# Altium schematic sheet MC21R01_Inverter_2.SchDoc: MC21R01 Top Level
size A3; Author: AMP; DrawnBy: AMP; Organization: Altium Limited; Address1: 3 Minna Close; Address2: Belrose; Address3: NSW 2085; Address4: Australia; DocumentNumber: 0; Revision: 1.0; SheetNumber: 0; SheetTotal: 0
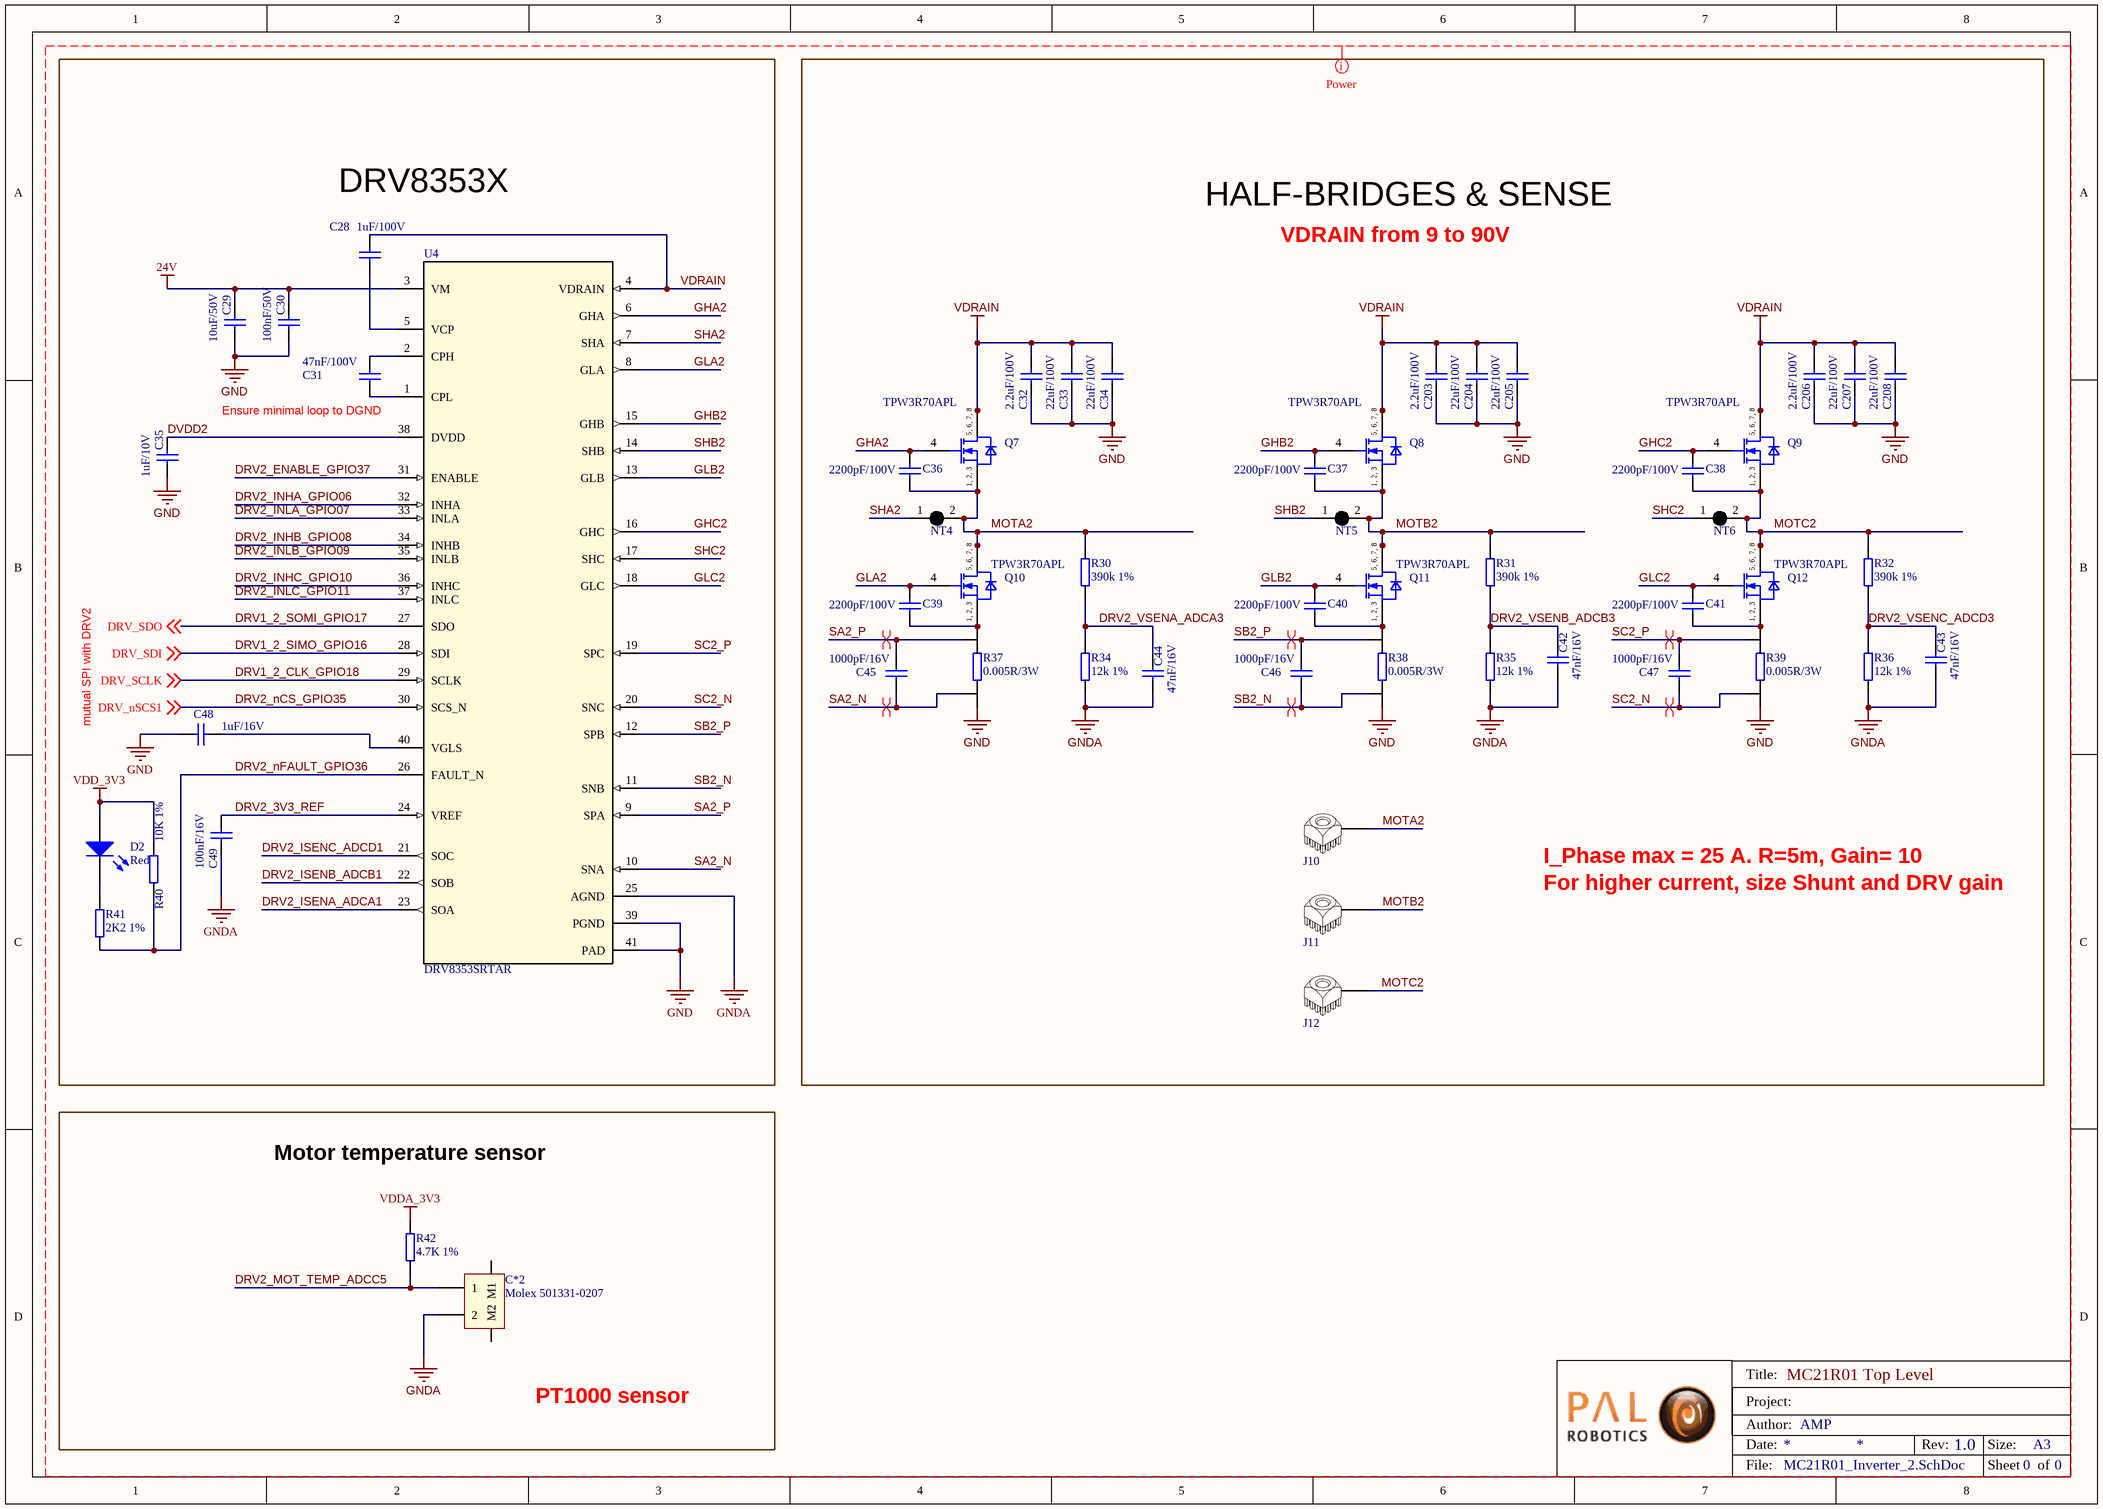
[diagram p0: MC21R01_Inverter_2.SchDoc]

## Parts
C28  value 1uF/100V  [0805 SMD capacitor]  (hidden comment: 1uF/100V 0805 10% X7R)
C29  value 10uF/50V  [1206 SMD Capacitor]  (hidden comment: 10uf/50V 1206 20% X5R)
C30  value 100nF/50V  [0603 SMD capacitor]  (hidden comment: 100nF/50V 0603 10% X7R)
C31  value 47nF/100V  [0603 SMD capacitor]  (hidden comment: 47nF/100V 0603 10% X7R)
C32  value 2.2uF/100V  [1210 SMD capacitor h=2mm]  (hidden comment: 2.2uF/100V 1210 10% X7R)
C33  value 22uF/100V  [2220 SMD Capacitor H=5MM]  (hidden comment: 22uF/100V 2220 20% X7S)
C34  value 22uF/100V  [2220 SMD Capacitor H=5MM]  (hidden comment: 22uF/100V 2220 20% X7S)
C35  value 1uF/10V  [0603 SMD capacitor]  (hidden comment: 1uF/10V 0603 10% X7R)
C36  value 2200pF/100V  [0402 SMD Capacitor]  (hidden comment: 2200pF/100V 0402 10% X7S)
C37  value 2200pF/100V  [0402 SMD Capacitor]  (hidden comment: 2200pF/100V 0402 10% X7S)
C38  value 2200pF/100V  [0402 SMD Capacitor]  (hidden comment: 2200pF/100V 0402 10% X7S)
C39  value 2200pF/100V  [0402 SMD Capacitor]  (hidden comment: 2200pF/100V 0402 10% X7S)
C40  value 2200pF/100V  [0402 SMD Capacitor]  (hidden comment: 2200pF/100V 0402 10% X7S)
C41  value 2200pF/100V  [0402 SMD Capacitor]  (hidden comment: 2200pF/100V 0402 10% X7S)
C42  value 47nF/16V  [0402 SMD Capacitor]  (hidden comment: 47nF/16V 0402 10% X7R)
C43  value 47nF/16V  [0402 SMD Capacitor]  (hidden comment: 47nF/16V 0402 10% X7R)
C44  value 47nF/16V  [0402 SMD Capacitor]  (hidden comment: 47nF/16V 0402 10% X7R)
C45  value 1000pF/16V  [0402 SMD Capacitor]  (hidden comment: 1000pF/16V 0402 10% X7R)
C46  value 1000pF/16V  [0402 SMD Capacitor]  (hidden comment: 1000pF/16V 0402 10% X7R)
C47  value 1000pF/16V  [0402 SMD Capacitor]  (hidden comment: 1000pF/16V 0402 10% X7R)
C48  value 1uF/16V  [0603 SMD capacitor]  (hidden comment: 1uF/16V 0603 10% X7R)
C49  value 100nF/16V  [0402 SMD Capacitor]  (hidden comment: 100nF/16V 0402 10% X7R)
C203  value 2.2uF/100V  [1210 SMD capacitor h=2mm]  (hidden comment: 2.2uF/100V 1210 10% X7R)
C204  value 22uF/100V  [2220 SMD Capacitor H=5MM]  (hidden comment: 22uF/100V 2220 20% X7S)
C205  value 22uF/100V  [2220 SMD Capacitor H=5MM]  (hidden comment: 22uF/100V 2220 20% X7S)
C206  value 2.2uF/100V  [1210 SMD capacitor h=2mm]  (hidden comment: 2.2uF/100V 1210 10% X7R)
C207  value 22uF/100V  [2220 SMD Capacitor H=5MM]  (hidden comment: 22uF/100V 2220 20% X7S)
C208  value 22uF/100V  [2220 SMD Capacitor H=5MM]  (hidden comment: 22uF/100V 2220 20% X7S)
C*2  Molex 501331-0207  [Molex 501331-0207]
D2  Red  [0402 SMD LED Red]
J10  WE_7461094  [WE_7461094]  (value not drawn)
J11  WE_7461094  [WE_7461094]  (value not drawn)
J12  WE_7461094  [WE_7461094]  (value not drawn)
NT4  Net Tie SMD  [Net Tie SMD 0.4x0.8mm]  (value not drawn)  (net tie, no BOM)
NT5  Net Tie SMD  [Net Tie SMD 0.4x0.8mm]  (value not drawn)  (net tie, no BOM)
NT6  Net Tie SMD  [Net Tie SMD 0.4x0.8mm]  (value not drawn)  (net tie, no BOM)
Q7  TPW3R70APL  [DSOP Advance Toshiba]
Q8  TPW3R70APL  [DSOP Advance Toshiba]
Q9  TPW3R70APL  [DSOP Advance Toshiba]
Q10  TPW3R70APL  [DSOP Advance Toshiba]
Q11  TPW3R70APL  [DSOP Advance Toshiba]
Q12  TPW3R70APL  [DSOP Advance Toshiba]
R30  390k 1%  [0603 SMD resistor]
R31  390k 1%  [0603 SMD resistor]
R32  390k 1%  [0603 SMD resistor]
R34  12k 1%  [0603 SMD resistor]
R35  12k 1%  [0603 SMD resistor]
R36  12k 1%  [0603 SMD resistor]
R37  0.005R/3W  [2512 SMD Resistor V2 NETTIE]
R38  0.005R/3W  [2512 SMD Resistor V2 NETTIE]
R39  0.005R/3W  [2512 SMD Resistor V2 NETTIE]
R40  10K 1%  [0402 SMD rESISTOR]
R41  2K2 1%  [0402 SMD rESISTOR]
R42  4.7K 1%  [0402 SMD rESISTOR]
U4  DRV8353SRTAR  [QFN50P600X600X80_HS-41N]

## Blocks framed on the sheet
DRV8353X: C28-C31 C35 C48 C49 D2 R40 R41 U4
HALF-BRIDGES & SENSE: C32-C34 C36-C47 C203-C208 J10-J12 NT4-NT6 Q7-Q12 R30-R32 R34-R39

## Nets
24V: C29.1 C30.1 U4.3(VM)
GND: C29.2 C30.2 C32.2 C33.2 C34.2 C35.2 C48.1 C203.2 C204.2 C205.2 C206.2 C207.2 C208.2 R37.1 R38.1 R39.1 U4.39(PGND) U4.41(PAD)
GNDA: C42.2 C43.2 C44.2 C49.2 C*2.2 R34.1 R35.1 R36.1 U4.25(AGND)
VDD_3V3: D2.A R40.2
VDDA_3V3: R42.2
VDRAIN: C28.1 C32.1 C33.1 C34.1 C203.1 C204.1 C205.1 C206.1 C207.1 C208.1 Q7.5(DRAIN) Q7.6(DRAIN) Q7.7(DRAIN) Q7.8(DRAIN) Q8.5(DRAIN) Q8.6(DRAIN) Q8.7(DRAIN) Q8.8(DRAIN) Q9.5(DRAIN) Q9.6(DRAIN) Q9.7(DRAIN) Q9.8(DRAIN) U4.4(VDRAIN)
DRV1_2_CLK_GPIO18: U4.29(SCLK) ; off-sheet DRV_SCLK  [also labelled DRV_SCLK]
DRV1_2_SIMO_GPIO16: U4.28(SDI) ; off-sheet DRV_SDI  [also labelled DRV_SDI]
DRV1_2_SOMI_GPIO17: U4.27(SDO) ; off-sheet DRV_SDO  [also labelled DRV_SDO]
DRV2_3V3_REF: C49.1 U4.24(VREF)
DRV2_ENABLE_GPIO37: U4.31(ENABLE)
DRV2_INHA_GPIO06: U4.32(INHA)
DRV2_INHB_GPIO08: U4.34(INHB)
DRV2_INHC_GPIO10: U4.36(INHC)
DRV2_INLA_GPIO07: U4.33(INLA)
DRV2_INLB_GPIO09: U4.35(INLB)
DRV2_INLC_GPIO11: U4.37(INLC)
DRV2_ISENA_ADCA1: U4.23(SOA)
DRV2_ISENB_ADCB1: U4.22(SOB)
DRV2_ISENC_ADCD1: U4.21(SOC)
DRV2_MOT_TEMP_ADCC5: C*2.1 R42.1
DRV2_nCS_GPIO35: U4.30(SCS_N) ; off-sheet DRV_nSCS1  [also labelled DRV_nSCS1]
DRV2_nFAULT_GPIO36: R40.1 R41.1 U4.26(FAULT_N)
DRV2_VSENA_ADCA3: C44.1 R30.1 R34.2
DRV2_VSENB_ADCB3: C42.1 R31.1 R35.2
DRV2_VSENC_ADCD3: C43.1 R32.1 R36.2
DVDD2: C35.1 U4.38(DVDD)
GHA2: C36.1 Q7.4(GATE) U4.6(GHA)
GHB2: C37.1 Q8.4(GATE) U4.15(GHB)
GHC2: C38.1 Q9.4(GATE) U4.16(GHC)
GLA2: C39.1 Q10.4(GATE) U4.8(GLA)
GLB2: C40.1 Q11.4(GATE) U4.13(GLB)
GLC2: C41.1 Q12.4(GATE) U4.18(GLC)
MOTA2: C36.2 J10.1 NT4.2 Q7.1(SOURCE) Q7.2(SOURCE) Q7.3(SOURCE) Q10.5(DRAIN) Q10.6(DRAIN) Q10.7(DRAIN) Q10.8(DRAIN) R30.2
MOTB2: C37.2 J11.1 NT5.2 Q8.1(SOURCE) Q8.2(SOURCE) Q8.3(SOURCE) Q11.5(DRAIN) Q11.6(DRAIN) Q11.7(DRAIN) Q11.8(DRAIN) R31.2
MOTC2: C38.2 J12.1 NT6.2 Q9.1(SOURCE) Q9.2(SOURCE) Q9.3(SOURCE) Q12.5(DRAIN) Q12.6(DRAIN) Q12.7(DRAIN) Q12.8(DRAIN) R32.2
SA2_N: C45.2 R37.3 U4.10(SNA)
SA2_P: C45.1 R37.4 U4.9(SPA)
SB2_N: C46.2 R38.3 U4.11(SNB)
SB2_P: C46.1 R38.4 U4.12(SPB)
SC2_N: C47.2 R39.3 U4.20(SNC)
SC2_P: C47.1 R39.4 U4.19(SPC)
SHA2: NT4.1 U4.7(SHA)
SHB2: NT5.1 U4.14(SHB)
SHC2: NT6.1 U4.17(SHC)
NetC28_2: C28.2 U4.5(VCP)
NetC31_1: C31.1 U4.2(CPH)
NetC31_2: C31.2 U4.1(CPL)
NetC39_2: C39.2 Q10.1(SOURCE) Q10.2(SOURCE) Q10.3(SOURCE) R37.2
NetC40_2: C40.2 Q11.1(SOURCE) Q11.2(SOURCE) Q11.3(SOURCE) R38.2
NetC41_2: C41.2 Q12.1(SOURCE) Q12.2(SOURCE) Q12.3(SOURCE) R39.2
NetC48_2: C48.2 U4.40(VGLS)
NetD2_K: D2.K R41.2

Not connected (* = marked no-connect by the designer): C*2 M1 M2

## Layout directives
net class Power: 24V, DRV1_2_CLK_GPIO18, DRV1_2_SIMO_GPIO16, DRV1_2_SOMI_GPIO17, DRV2_3V3_REF, DRV2_ENABLE_GPIO37, DRV2_INHA_GPIO06, DRV2_INHB_GPIO08, DRV2_INHC_GPIO10, DRV2_INLA_GPIO07, DRV2_INLB_GPIO09, DRV2_INLC_GPIO11, DRV2_ISENA_ADCA1, DRV2_ISENB_ADCB1, DRV2_ISENC_ADCD1, DRV2_MOT_TEMP_ADCC5, DRV2_nCS_GPIO35, DRV2_nFAULT_GPIO36, DRV2_VSENA_ADCA3, DRV2_VSENB_ADCB3, DRV2_VSENC_ADCD3, DRV_nSCS1, DRV_SCLK, DRV_SDI, DRV_SDO, DVDD2, GHA2, GHB2, GHC2, GLA2, GLB2, GLC2, GND, GNDA, MOTA2, MOTB2, MOTC2, SA2_N, SA2_P, SB2_N, SB2_P, SC2_N, SC2_P, SHA2, SHB2, SHC2, VDD_3V3, VDDA_3V3, VDRAIN
differential pair; differential pair class ADC: SA2_N, SA2_P, SB2_N, SB2_P, SC2_N, SC2_P

## Notes on the sheet
- VDRAIN from 9 to 90V
- (near C31) Ensure minimal loop to DGND
- mutual SPI with DRV2
- I_Phase max = 25 A. R=5m, Gain= 10
- For higher current, size Shunt and DRV gain
- Motor temperature sensor
- PT1000 sensor
- Title:
- Date:
- Project:
- Author:
- Rev:
- Size:
- A3
- File:
- Sheet
- of
- (in symbol TPW3R70APL) 5, 6, 7, 8; 1, 2, 3

## Library data of the parts
C28 = 1uF/100V 0805 10% X7R: 1 uF 100 V 0805  ±10% Tolerance X7R Multilayer Ceramic Chip Capacitor; Manufacturer 1: AVX; Manufacturer Part Number 1: 08051C105K4T2A; Supplier 1: Farnell; Supplier 2: Mouser; Supplier Part Number 1: 2834935; Supplier Part Number 2: 581-08051C105K4T2A
C29 = 10uF/50V 1206 20% X5R: 10 uF 50 V 1206 ±20% Tolerance X5R Multilayer Ceramic Chip Capacitor; Manufacturer 1: Samsung; Manufacturer Part Number 1: CL31A106MBHNNNE; Supplier 1: Digi-key; Supplier Part Number 1: 1276-6736-1-ND
C30 = 100nF/50V 0603 10% X7R: 100 nF 50 V 0603  ±10% Tolerance X7R Multilayer Ceramic Chip Capacitor; Manufacturer 1: Samsung; Manufacturer Part Number 1: CL10B104KB8NNNC; Supplier Part Number 1: 1276-1000-1-ND; Supplier 1: Digi-key
C31 = 47nF/100V 0603 10% X7R_1: 47 nF 100 V 0603 ±10% Tolerance X7R Multilayer Ceramic Chip Capacitor; Manufacturer 1: KEMET; Manufacturer Part Number 1: C0603C473K1RACTU; Supplier 1: Farnell; Supplier Part Number 1: 1865550
C32 C203 C206 = 2.2uF/100V 1210 10% X7R: 2.2 uF 100 V 1210  ±10% Tolerance X7R Multilayer Ceramic Chip Capacitor; Manufacturer 1: KEMET; Manufacturer Part Number 1: C1210C225K1RACTU; Supplier 1: Farnell; Supplier Part Number 1: 1793832
C33 C34 C204 C205 C207 C208 = 22uF/100V 2220 20% X7S: 22 uF 100 V 2220 ±20% Tolerance X7S Multilayer Ceramic Chip Capacitor; Manufacturer 1: TDK; Manufacturer Part Number 1: CKG57NX7S2A226M500JH; Supplier 1: Farnell; Supplier Part Number 1: 2210742
C35 = 1uF/10V 0603 10% X7R: 1uF/10V 0603 10% Tolerance X7R Multilayer Ceramic Chip Capacitor; Manufacturer 1: TAIYO YUDEN; Manufacturer Part Number 1: LMK107B7105KA-T; Supplier Part Number 1: 2112849; Supplier 1: Farnell
C36-C41 = 2200pF/100V 0402 10% X7S: 2200pF/100V 0402 10% Tolerance X7S Multilayer Ceramic Chip Capacitor; Manufacturer 1: TDK; Manufacturer Part Number 1: C1005X7S2A222K050BB; Supplier 1: Farnell; Supplier Part Number 1: 2906779
C42-C44 = 47nF/16V 0402 10% X7R: 47nF/16V 0402 10% Tolerance X7R Multilayer Ceramic Chip Capacitor; Manufacturer 1: Walsin; Manufacturer Part Number 1: 0402B473J160CT; Supplier 1: Farnell; Supplier Part Number 1: 2524710
C45-C47 = 1000pF/16V 0402 10% X7R_1: 1000pF/16V 0402 10% Tolerance X7R Multilayer Ceramic Chip Capacitor; Manufacturer 1: KEMET; Manufacturer Part Number 1: C0402C102K4RACTU; Supplier 1: Farnell; Supplier Part Number 1: 2522378
C48 = 1uF/16V 0603 10% X7R: 1uF/16V 0603 10% Tolerance X7R Multilayer Ceramic Chip Capacitor; Manufacturer 1: TAIYO YUDEN; Manufacturer Part Number 1: EMK107B7105KA-T; Supplier Part Number 1: 2112839; Supplier 1: Farnell
C49 = 100nF/16V 0402 10% X7R: 100nF/16V 0402 10% Tolerance X7R Multilayer Ceramic Chip Capacitor; Manufacturer 1: SAMSUNG; Manufacturer Part Number 1: CL05B104KO5VPNC; Supplier Part Number 1: 3013350; Supplier 1: Farnell
C*2 = Molex 501331-0207: PicoClasp 02 pin vertical; Supplier 1: Farnell; Supplier Part Number 1: 1835976
D2 = LED_0402_Red: Low Profile Chip LED, Red; Manufacturer: ROHM; Manufacturer Part Number: SML-P11UTT86R; Supplier 1: Farnell; Supplier Part Number 1: 2507545
J10-J12 = WE_7461094: REDCUBE PRESS-FIT with external thread and full plain pin-plate WPSHFU, 130A, M3 screw, 9pins; Manufacturer: WURTH ELEKTRONIK; Manufacturer Part Number: 7461094; Created by: Yaiza Montes; Published: 29/05/20; Value: WE_7461094; Supplier 1: Farnell; Supplier 2: Mouser; Supplier 3: Digi-Key; Supplier Part Number 1: 1821284; Supplier Part Number 2: 710-7461094; Supplier Part Number 3: 732-3212-ND
NT4-NT6 = Net Tie SMD: Net Tie starpoint
Q7-Q12 = TPW3R70APL: Silicon N-channel MOS (U-MOS-H); Manufacturer: Toshiba Semicon; Manufacturer Order Number: TPW3R70APL; PackageReference: DSOP Advance; Supplier 1: Mouser; Supplier 2: Mouser; Supplier Part Number 1: 757-TPW3R70APLL1Q; Supplier Part Number 2: 757-TPW3R70APLL1Q
R30-R32 = 390k/150V 1% 0603 250mW: 390k/150V 1% 0603 250mW SMD Resistor; Manufacturer 1: Panasonic; Manufacturer Part Number 1: ERJPA3F3903V; Supplier 1: Farnell; Supplier Part Number 1: 2335911
R34-R36 = 12k/150V 1% 0603 250mW: 12k/150V 1% 0603 250mW SMD Resistor; Manufacturer 1: Panasonic; Manufacturer Part Number 1: ERJPA3F1202V; Supplier 1: Farnell; Supplier Part Number 1: 2335844
R37-R39 = 0.005R/3W 1% 2512 Shunt: 0.005R/3W 1% 2512 shunt SMD Resistor; Manufacturer 1: Bourns; Manufacturer Part Number 1: CRE2512-FZ-R005E-3; Supplier 1: Farnell; Supplier Part Number 1: 2434014
R40 = 10K/50V 1% 0402 100mW: 10K/50V 1% 0402 100mW SMD Resistor; Manufacturer 1: Yageo; Manufacturer Part Number 1: RC0402FR-0710KL; Supplier 1: Farnell; Supplier Part Number 1: 9239359; Value: 10K
R41 = 2K2/50V 1% 0402 100mW: 2K2/50V 1% 0402 100mW SMD Resistor; Manufacturer 1: Yageo; Manufacturer Part Number 1: RC0402FR-072K2L; Value: 2.2k; Supplier 1: Farnell; Supplier Part Number 1: 9239278
R42 = 4.7K/50V 1% 0402 100mW: 4.7K/50V 1% 0402 100mW SMD Resistor; Manufacturer 1: Vishay; Manufacturer Part Number 1: CRCW04024K70FKED; Supplier 1: Farnell; Supplier Part Number 1: 1469712; Value: 4.7K
U4 = DRV8353SRTAR: 102-V max 3-phase smart gate driver with current shunt amplifiers; Manufacturer: Texas Instruments; PartNumber: DRV8353SRTAR; RefDes: RefDes; TYPE: TYPE; Value: Value; Supplier 1: Arrow; Manufacturer Part Number: DRV8353SRTAR; RoHS: No; Stock 1: 2000; Pricing 1: 2000=3,20540, 4000=3,09430, 10000=3,08440, 50000=3,06460 (USD); Supplier Part Number 1: DRV8353SRTAR